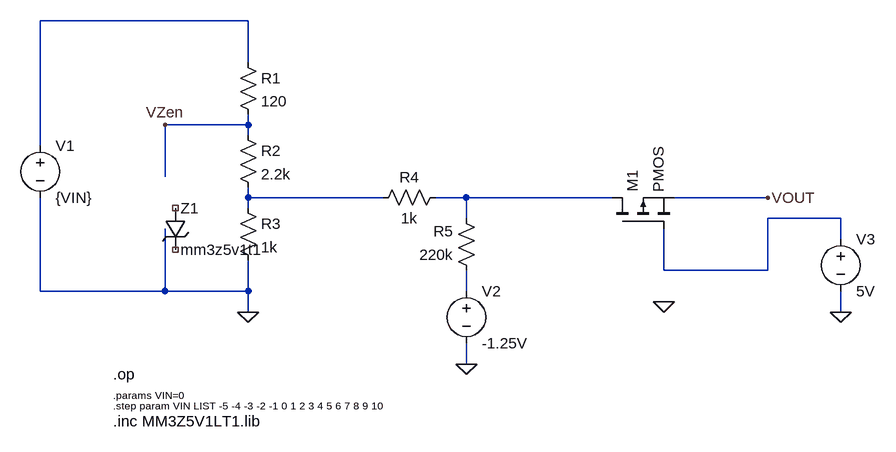
[diagram p0: schematic cyclops_r3.5_input-circuit.asc]
cyclops_r3.5_input-circuit.asc, the LTspice schematic file:
Version 4
SHEET 1 1276 680
WIRE 256 -16 -64 -16
WIRE 256 48 256 -16
WIRE 256 144 256 128
WIRE 256 144 128 144
WIRE 256 160 256 144
WIRE -64 176 -64 -16
WIRE 128 224 128 144
WIRE 256 256 256 240
WIRE 464 256 256 256
WIRE 592 256 544 256
WIRE 816 256 592 256
WIRE 1056 256 912 256
WIRE 256 272 256 256
WIRE 592 288 592 256
WIRE 1168 288 1056 288
WIRE 1168 320 1168 288
WIRE 896 368 896 304
WIRE 1056 368 1056 288
WIRE 1056 368 896 368
WIRE -64 400 -64 256
WIRE 128 400 128 304
WIRE 128 400 -64 400
WIRE 256 400 256 352
WIRE 256 400 128 400
WIRE 592 400 592 368
WIRE 256 432 256 400
WIRE 1168 432 1168 400
WIRE 592 512 592 480
FLAG 256 432 0
FLAG 128 144 VZen
FLAG 592 512 0
FLAG 896 416 0
FLAG 1056 256 VOUT
FLAG 1168 432 0
SYMBOL res 240 32 R0
SYMATTR InstName R1
SYMATTR Value 120
SYMBOL res 240 144 R0
SYMATTR InstName R2
SYMATTR Value 2.2k
SYMBOL res 240 256 R0
SYMATTR InstName R3
SYMATTR Value 1k
SYMBOL voltage -64 160 R0
WINDOW 123 0 0 Left 2
WINDOW 39 0 0 Left 2
SYMATTR InstName V1
SYMATTR Value {VIN}
SYMBOL zener 128 272 R0
SYMATTR InstName Z1
SYMATTR Prefix X
SYMATTR Value mm3z5v1t1
SYMBOL res 560 240 R90
WINDOW 0 0 56 VBottom 2
WINDOW 3 32 56 VTop 2
SYMATTR InstName R4
SYMATTR Value 1k
SYMBOL res 608 384 R180
WINDOW 0 36 76 Left 2
WINDOW 3 36 40 Left 2
SYMATTR InstName R5
SYMATTR Value 220k
SYMBOL voltage 592 384 R0
WINDOW 123 0 0 Left 2
WINDOW 39 0 0 Left 2
SYMATTR InstName V2
SYMATTR Value -1.25V
SYMBOL pmos 816 304 R270
SYMATTR InstName M1
SYMBOL voltage 1168 304 R0
WINDOW 123 0 0 Left 2
WINDOW 39 0 0 Left 2
SYMATTR InstName V3
SYMATTR Value 5V
TEXT 48 528 Left 2 !.op
TEXT 48 560 Left 1 !.params VIN=0
TEXT 48 576 Left 1 !.step param VIN LIST -5 -4 -3 -2 -1 0 1 2 3 4 5 6 7 8 9 10
TEXT 48 600 Left 2 !.inc MM3Z5V1LT1.lib

The netlist it stands for:
* cyclops_r3.5_input-circuit.asc
R1 N001 VZen 120
R2 VZen N002 2.2k
R3 N002 0 1k
V1 N001 0 {VIN}
XZ1 NC_01 NC_02 mm3z5v1t1  ; pins + -
R4 N003 N002 1k
R5 N005 N003 220k
V2 N005 0 -1.25V
M1 N003 N004 VOUT VOUT PMOS
V3 N004 0 5V
.model NMOS NMOS
.model PMOS PMOS
.lib standard.mos
.op
.params VIN=0
.step param VIN LIST -5 -4 -3 -2 -1 0 1 2 3 4 5 6 7 8 9 10
.inc MM3Z5V1LT1.lib
.backanno
.end